# EAGLE design dongle (EAGLE 9.0.1)
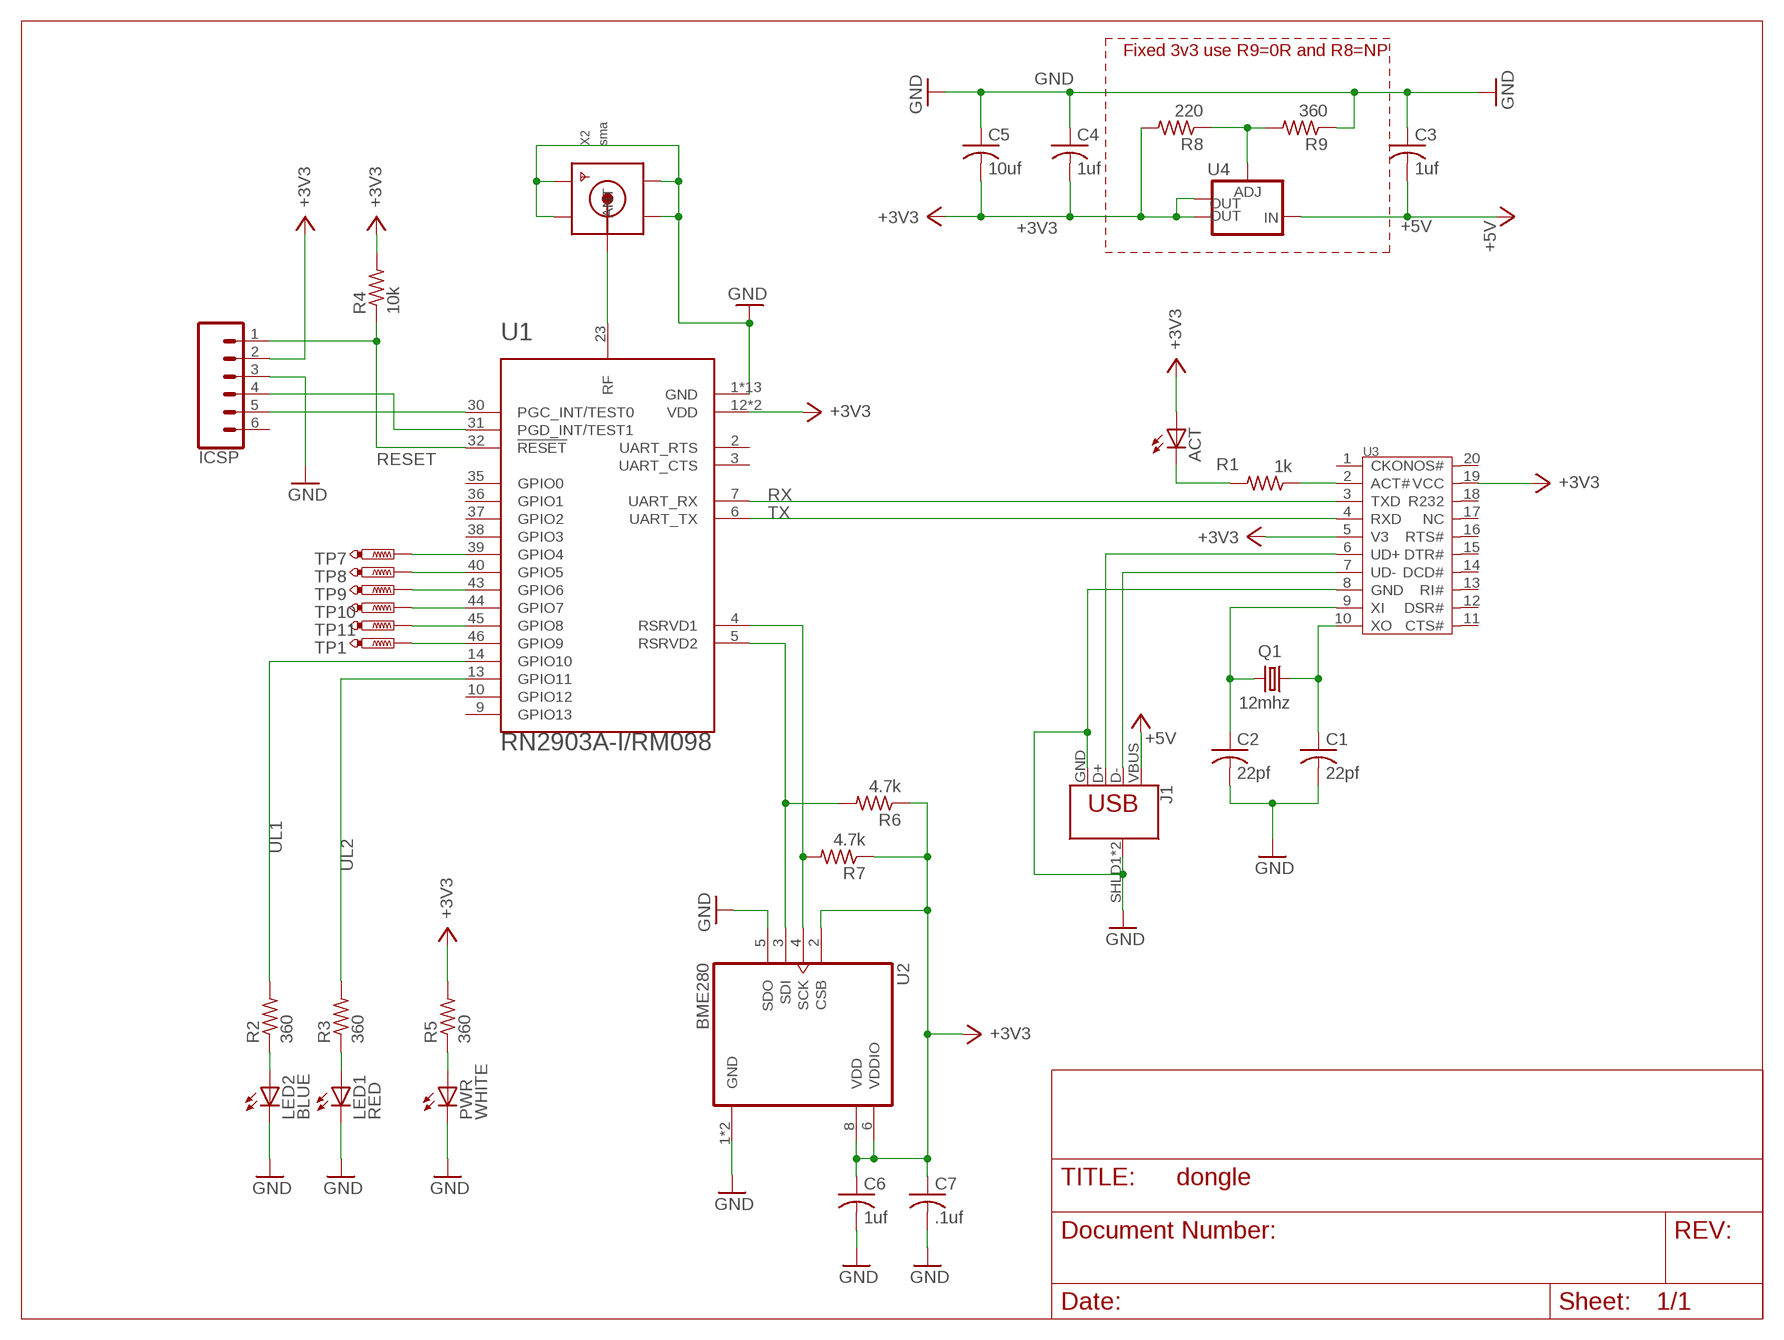
[diagram p0: schematic, sheet 1]

## Parts
ACT  LEDCHIP-LED0603  [CHIP-LED0603]
C1  22pf  C-USC0603K  [C0603K]
C2  22pf  C-USC0603K  [C0603K]
C3  1uf  C-USC0603K  [C0603K]
C4  1uf  C-USC0603K  [C0603K]
C5  10uf  C-USC1206K  [C1206K]
C6  1uf  C-USC0603K  [C0603K]
C7  .1uf  C-USC0603K  [C0603K]
ICSP  CONN_06SMD-FEMALE-V2  [1X06-SMD-FEMALE]
J1  USB_A_PTH_MALE  [USB-A-H]
LED1  RED  LEDCHIP-LED0603  [CHIP-LED0603]
LED2  BLUE  LEDCHIP-LED0603  [CHIP-LED0603]
PWR  WHITE  LEDCHIP-LED0603  [CHIP-LED0603]
Q1  12mhz  CRYSTALSM49  [SM49]
R1  1k  R-US_R0603  [R0603]
R2  360  R-US_R0603  [R0603]
R3  360  R-US_R0603  [R0603]
R4  10k  R-US_R0603  [R0603]
R5  360  R-US_R0603  [R0603]
R6  4.7k  R-US_R0603  [R0603]
R7  4.7k  R-US_R0603  [R0603]
R8  220  R-US_R0603  [R0603]
R9  360  R-US_R0603  [R0603]
TP1  PTR1B1,27  [B1,27]
TP7  PTR1B1,27  [B1,27]
TP8  PTR1B1,27  [B1,27]
TP9  PTR1B1,27  [B1,27]
TP10  PTR1B1,27  [B1,27]
TP11  PTR1B1,27  [B1,27]
U1  RN2903A-I/RM098  [XCVR_RN2903A-I/RM098]
U2  BME280  [PSON65P250X250X100-8N]
U3  INTERFACE-CH340T(SSOP20)  [SSOP20-0.65-7.6X5.2MM]
U4  V_REG_LM1117SOT223  [SOT223]
X2  sma  SMACONNECTOR_EDGE  [SMA_EDGELAUNCH]

## Nets
+3V3: ACT.A C4.2 C5.2 C6.1 C7.1 ICSP.2 R4.2 R5.2 R6.1 R7.1 R8.2 U1.12(VDD) U1.34(VDD) U2.2(CSB) U2.6(VDDIO) U2.8(VDD) U3.5(V3) U3.19(VCC) U4.2(OUT) U4.4(OUT)
+5V: C3.2 J1.VBUS U4.3(IN)
GND: C1.2 C2.2 C3.1 C4.1 C5.1 C6.2 C7.2 ICSP.3 J1.GND J1.SHLD1(SHIELD) J1.SHLD2(SHIELD) LED1.C LED2.C PWR.C R9.1 U1.1(GND) U1.8(GND) U1.11(GND) U1.20(GND) U1.21(GND) U1.22(GND) U1.24(GND) U1.26(GND) U1.27(GND) U1.28(GND) U1.33(GND) U1.41(GND) U1.47(GND) U2.1(GND) U2.5(SDO) U2.7(GND) U3.8(GND) X2.GND@1(GND4) X2.GND@2(GND3) X2.GND@3(GND2) X2.GND@4(GND1)
N$1: U1.23(RF) X2.P(ANT)
N$2: R1.1 U3.2(ACT#)
N$3: ACT.C R1.2
N$4: J1.D+ U3.6(UD+)
N$5: J1.D- U3.7(UD-)
N$6: C1.1 Q1.1 U3.10(XO)
N$7: C2.1 Q1.2 U3.9(XI)
N$9: ICSP.4 U1.31(PGD_INT/TEST1)
N$10: ICSP.5 U1.30(PGC_INT/TEST0)
N$11: R7.2 U1.4(RSRVD1) U2.4(SCK)
N$12: R6.2 U1.5(RSRVD2) U2.3(SDI)
N$13: LED2.A R2.1
N$14: LED1.A R3.1
N$17: PWR.A R5.1
N$21: TP1.TP U1.46(GPIO9)
N$22: R8.1 R9.2 U4.1(ADJ)
N$29: TP7.TP U1.39(GPIO4)
N$30: TP8.TP U1.40(GPIO5)
N$31: TP9.TP U1.43(GPIO6)
N$32: TP10.TP U1.44(GPIO7)
N$33: TP11.TP U1.45(GPIO8)
RESET: ICSP.1 R4.1 U1.32(!RESET)
RX: U1.7(UART_RX) U3.3(TXD)
TX: U1.6(UART_TX) U3.4(RXD)
UL1: R2.2 U1.14(GPIO10)
UL2: R3.2 U1.13(GPIO11)
Unconnected: ICSP.6 U1.2(UART_RTS) U1.3(UART_CTS) U1.9(GPIO13) U1.10(GPIO12) U1.35(GPIO0) U1.36(GPIO1) U1.37(GPIO2) U1.38(GPIO3) U3.1(CKO) U3.11(CTS#) U3.12(DSR#) U3.13(RI#) U3.14(DCD#) U3.15(DTR#) U3.16(RTS#) U3.17(NC) U3.18(R232) U3.20(NOS#)

## Notes on the sheet
- Fixed 3v3 use R9=0R and R8=NP

## Library data of the parts
ACT LED1 LED2 PWR = led:LED: LED OSRAM: - CHIPLED LG R971, LG N971, LY N971, LG Q971, LY Q971, LO R971, LY R971 LH N974, LH R974 LS Q976, LO Q976, LY Q976 LO Q996 - Hyper CHIPLED LW Q18S LB Q993, LB Q99A, LB R99A - SideLED LS A670, LO A670, LY A670, LG A670, LP A670 LB A673, LV A673, LT A673, LW A673 LH A674 LY A675 LS A676, LA A676, LO A676, LY A676, LW A676 LS A679, LY A679, LG A679 - Hyper Micro SIDELED® LS Y876, LA Y876, LO Y876, LY Y876 LT Y87S - SmartLED LW L88C, LW L88S LB L89C, LB L89S, LG L890 LS L89K, LO L89K, LY L89K LS L896, LA L896, LO L896, LY L896 - TOPLED LS T670, LO T670, LY T670, LG T670, LP T670 LSG T670, LSP T670, LSY T670, LOP T670, LYG T670 LG T671, LOG T671, LSG T671 LB T673, LV T673, LT T673, LW T673 LH T674 LS T676, LA T676, LO T676, LY T676, LB T676, LH T676, LSB T676, LW T676 LB T67C, LV T67C, LT T67C, LS T67K, LO T67K, LY T67K, LW E67C LS E67B, LA E67B, LO E67B, LY E67B, LB E67C, LV E67C, LT E67C LW T67C LS T679, LY T679, LG T679 LS T770, LO T770, LY T770, LG T770, LP T770 LB T773, LV T773, LT T773, LW T773 LH T774 LS E675, LA E675, LY E675, LS T675 LS T776, LA T776, LO T776, LY T776, LB T776 LHGB T686 LT T68C, LB T68C - Hyper Mini TOPLED® LB M676 - Mini TOPLED Santana® LG M470 LS M47K, LO M47K, LY M47K Source: http://www.osram.convergy.de LUXEON: - LUMILED® LXK2-PW12-R00, LXK2-PW12-S00, LXK2-PW14-U00, LXK2-PW14-V00 LXK2-PM12-R00, LXK2-PM12-S00, LXK2-PM14-U00 LXK2-PE12-Q00, LXK2-PE12-R00, LXK2-PE12-S00, LXK2-PE14-T00, LXK2-PE14-U00 LXK2-PB12-K00, LXK2-PB12-L00, LXK2-PB12-M00, LXK2-PB14-N00, LXK2-PB14-P00, LXK2-PB14-Q00 LXK2-PR12-L00, LXK2-PR12-M00, LXK2-PR14-Q00, LXK2-PR14-R00 LXK2-PD12-Q00, LXK2-PD12-R00, LXK2-PD12-S00 LXK2-PH12-R00, LXK2-PH12-S00 LXK2-PL12-P00, LXK2-PL12-Q00, LXK2-PL12-R00 Source: www.luxeon.com KINGBRIGHT: KA-3528ASYC Source: www.kingbright.com
C1-C4 C6 C7 = rcl:C-US: CAPACITOR, American symbol; SPICEPREFIX: C
C5 = resistor:C-US: CAPACITOR, American symbol
ICSP = SparkFun-Connectors:CONN_06: Multi connection point. Often used as Generic Header-pin footprint for 0.1 inch spaced/style header connections On any of the 0.1 inch spaced packages, you can populate with these: Break Away Headers - Straight <https://www.sparkfun.com/products/116> (PRT-00116) Break Away Male Headers - Right Angle <https://www.sparkfun.com/products/553> (PRT-00553) Female Headers <https://www.sparkfun.com/products/115> (PRT-00115) Break Away Headers - Machine Pin <https://www.sparkfun.com/products/117> (PRT-00117) Break Away Female Headers - Swiss Machine Pin <https://www.sparkfun.com/products/743> (PRT-00743) Arduino Stackable Header - 6 Pin <https://www.sparkfun.com/products/9280> (PRT-09280) For SCREWTERMINALS and SPRING TERMINALS visit here: Screw Terimnals on SparkFun.com <https://www.sparkfun.com/search/results?term=Screw+Terminals> (5mm/3.5mm/2.54mm spacing) This device is also useful as a general connection point to wire up your design to another part of your project. Our various solder wires solder well into these plated through hole pads. Hook-Up Wire - Assortment (Stranded, 22 AWG) <https://www.sparkfun.com/products/11375> (PRT-11375) Hook-Up Wire - Assortment (Solid Core, 22 AWG) <https://www.sparkfun.com/products/11367> (PRT-11367) View the entire wire category on our website here <https://www.sparkfun.com/categories/141>; PROD_ID: CONN-09668
J1 = SparkFun-Connectors:USB_A: USB-A Connector Male and female variants, as well as PTH and SMT variants SparkFun Products: SparkFun XBee Explorer Dongle <https://www.sparkfun.com/products/11697> PTH Male SparkFun MicroView-USB Programmer <https://www.sparkfun.com/products/12924> SMT Male SparkFun USB Type A Female Breakout <https://www.sparkfun.com/products/12700> SMT Female; PROD_ID: CONN-08367; SF_ID: PRT-00437
Q1 = crystal:CRYSTAL: CRYSTAL; OC_FARNELL: unknown; OC_NEWARK: unknown
R1-R9 = resistor:R-US_: RESISTOR, American symbol
TP1 TP7-TP11 = testpad:PTR1: TEST PIN
U1 = bitsetters:RN2903A-I/RM098: 300kbps 18.5 dBm LoRa (Low Power Long Range) 915 MHz Transceiver Module; AVAILABILITY: Bad; DESCRIPTION: 300kbps 18.5 dBm LoRa _Low Power Long Range_ 915 MHz Transceiver Module; MF: Microchip; MP: RN2903A-I/RM098; PACKAGE: Module Microchip; PRICE: 12.18 USD
U2 = BME280:BME280: DIGITAL HUMIDITY, PRESSURE AND TEMPERATURE SENSOR * Digital interface I²C (up to 3.4 MHz) and SPI (3 and 4 wire, up to 10 MHz)* Supply voltage VDD main supply voltage range: 1.71 V to 3.6 V*VDDIO interface voltage range: 1.2 V to 3.6 V Operating range -40…+85 °C, 0…100 % rel. humidity, 300…1100 hPa The library has been designed by Richard Magdycz <https://www.facebook.com/groups/eaglecadsoftUK>; DESCRIPTION: Integrated pressure, humidity and temperature sensor; 8-pin 2.5x2.5x0.93mm LGA; DIGI-KEY_PART_NUMBER: 828-1063-1-ND; DIGI-KEY_PURCHASE_URL: https://www.digikey.com/product-detail/en/bosch-sensortec/BME280/828-1063-1-ND/6136314?utm_source=snapeda&utm_medium=aggregator&utm_campaign=symbol; MF: Bosch; MP: BME280; PACKAGE: LGA-8 Bosch
U3 = CH340T_SSOP20_:INTERFACE-CH340T(SSOP20): 310070026; AVAILABILITY: Unavailable; MF: Nanjing QinHeng Electronics; MP: CH340T; PACKAGE: None; PRICE: None
U4 = SparkFun-IC-Power:V_REG_LM1117: Voltage Regulator LM1117 Standard adjustable voltage regulator but in SMD form. Spark Fun Electronics SKU : COM-00595; PROD_ID: VREG-08170
X2 = adafruit:SMACONNECTOR: SMA Connector 90° DIP SMA Connector, 50 Ohm (4UConnector: 07259)

## Board
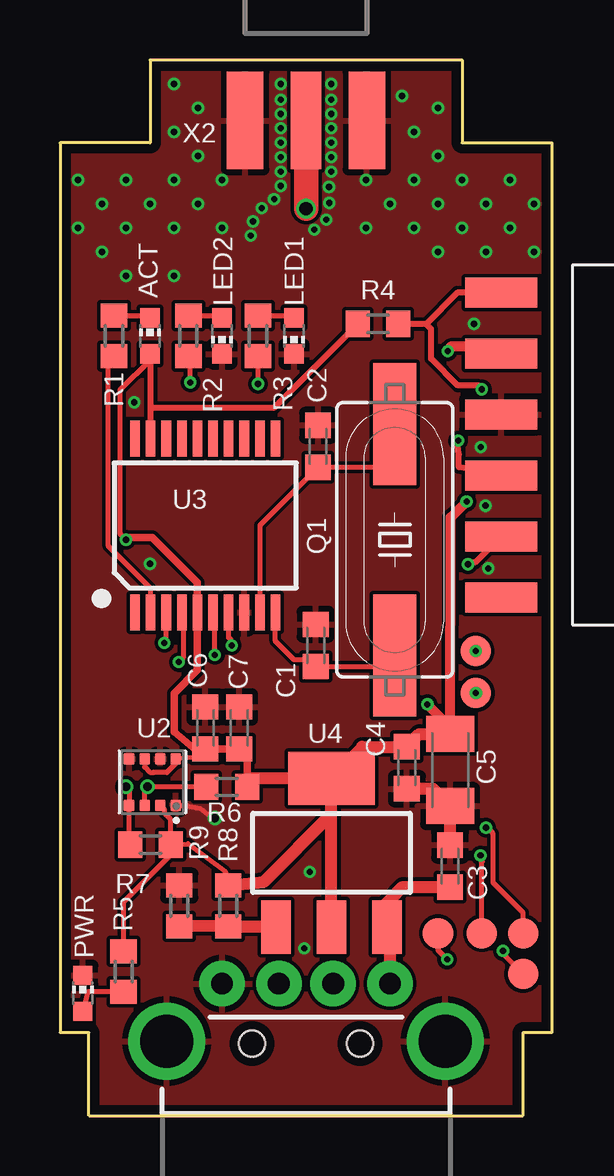
[diagram p1: board, top side]
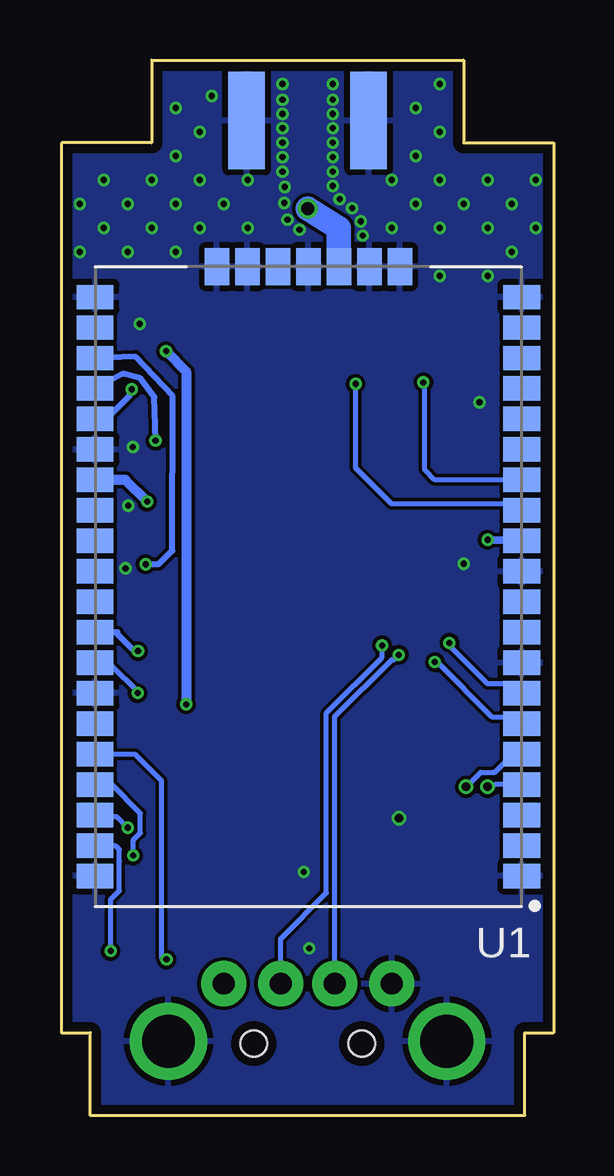
[diagram p2: board, bottom side, seen from below]

Size 20.5 x 44 mm. Coordinates in mm from the lower left corner, seen from the top.
Copper layers (1*16): Top 0.0356mm / dielectric 1.5011mm / Bottom 0.0356mm
Design rules "LaenPCBOrder *": minimum track width 6mil, minimum drill 10mil, track to track 6mil, track to pad 6mil, pad to pad 6mil, via to via 6mil, smd to smd 6mil, copper to edge 15mil, drill to drill 6mil, minimum pad ring 5mil, minimum via ring 5mil, stop-mask expansion 4mil, vias tented up to drill 15mil, thermal gap 10mil

### Footprints (pad centres in the part's own frame; a part is rotated, then mirrored left to right if it is on the bottom)
CHIP-LED0603 = smd 0.8 x 0.8: A 0,-0.75; C 0,0.75
C0603K = smd 1.05 x 1.08: 1 -0.875,0; 2 0.875,0
C1206K = smd 1.5 x 2: 1 -1.5,0; 2 1.5,0
1X06-SMD-FEMALE = smd 1.25 x 3: 1 6.35,3.425; 2 3.81,3.425; 3 1.27,3.425; 4 -1.27,3.425; 5 -3.81,3.425; 6 -6.35,3.425
USB-A-H = drill 0.914 pad 1.88: D+ 2.4,1.127; D- 2.4,-1.127; GND 2.4,3.5; VBUS 2.4,-3.5 | drill 2.2: SHLD1 0,-5.8; SHLD2 0,5.8 | hole 1.1: -0.1,2.25; -0.1,-2.25
SM49 = smd 5.08 x 1.778: 1 -4.826,0; 2 4.826,0
R0603 = smd 1 x 1.1: 1 -0.85,0; 2 0.85,0
B1,27 = smd 1.27 x 1.27: TP 0,0
XCVR_RN2903A-I/RM098 = smd 1.524 x 1.016: 1 8.89,-12.065; 2 8.89,-10.795; 3 8.89,-9.525; 4 8.89,-8.255; 5 8.89,-6.985; 6 8.89,-5.715; 7 8.89,-4.445; 8 8.89,-3.175; 9 8.89,-1.905; 10 8.89,-0.635; 11 8.89,0.635; 12 8.89,1.905; 13 8.89,3.175; 14 8.89,4.445; 15 8.89,5.715; 16 8.89,6.985; 17 8.89,8.255; 18 8.89,9.525; 19 8.89,10.795; 20 8.89,12.065; 28 -8.89,12.065; 29 -8.89,10.795; 30 -8.89,9.525; 31 -8.89,8.255; 32 -8.89,6.985; 33 -8.89,5.715; 34 -8.89,4.445; 35 -8.89,3.175; 36 -8.89,1.905; 37 -8.89,0.635; 38 -8.89,-0.635; 39 -8.89,-1.905; 40 -8.89,-3.175; 41 -8.89,-4.445; 42 -8.89,-5.715; 43 -8.89,-6.985; 44 -8.89,-8.255; 45 -8.89,-9.525; 46 -8.89,-10.795; 47 -8.89,-12.065 | smd 1.016 x 1.524: 21 3.81,13.335; 22 2.54,13.335; 23 1.27,13.335; 24 0,13.335; 25 -1.27,13.335; 26 -2.54,13.335; 27 -3.81,13.335
PSON65P250X250X100-8N = smd 0.49 x 0.45: 1 0.97,0.975; 2 0.97,0.325; 3 0.97,-0.325; 4 0.97,-0.975; 5 -0.97,-0.975; 6 -0.97,-0.325; 7 -0.97,0.325; 8 -0.97,0.975
SSOP20-0.65-7.6X5.2MM = smd 0.4 x 1.5: 1 -2.925,-3.625; 2 -2.275,-3.625; 3 -1.625,-3.625; 4 -0.975,-3.625; 5 -0.325,-3.625; 6 0.325,-3.625; 7 0.975,-3.625; 8 1.625,-3.625; 9 2.275,-3.625; 10 2.925,-3.625; 11 2.925,3.625; 12 2.275,3.625; 13 1.625,3.625; 14 0.975,3.625; 15 0.325,3.625; 16 -0.325,3.625; 17 -0.975,3.625; 18 -1.625,3.625; 19 -2.275,3.625; 20 -2.925,3.625
SOT223 = smd 1.219 x 2.235: 1 -2.311,-3.099; 2 0,-3.099; 3 2.311,-3.099 | smd 3.6 x 2.2: 4 0,3.099
SMA_EDGELAUNCH = smd 4.064 x 1.524: GND@1 2.032,-2.54; GND@2 2.032,2.54 | smd 4.064 x 1.524 bottom: GND@3 2.032,2.54; GND@4 2.032,-2.54 | smd 4.064 x 1.27: P 2.032,0

### Placement (x,y rotation side)
ACT  3.75,32.5 0 top
C1  10.65,19.6 90 top
C2  10.75,27.9 90 top
C3  16.25,10.4 270 top
C4  14.45,14.5 90 top
C5  16.25,14.4 90 top
C6  6.06,16.16 90 top
C7  7.47,16.16 90 top
ICSP  21.8,27.95 90 top
J1  10.25,3.1 90 top
LED1  9.75,32.5 180 top
LED2  6.75,32.5 180 top
PWR  0.95,5.1 0 top
Q1  13.95,24 90 top
R1  2.25,32.5 90 top
R2  5.35,32.5 270 top
R3  8.25,32.5 270 top
R4  13.25,33 180 top
R5  2.65,6 90 top
R6  6.95,13.7 180 top
R7  3.77,11.29 180 top
R8  7.01,8.74 90 top
R9  4.97,8.74 270 top
TP1  19.3,5.9 0 top
TP7  17.32,19.36 0 top
TP8  17.33,17.61 0 top
TP9  15.75,7.6 0 top
TP10  17.58,7.6 0 top
TP11  19.3,7.6 90 top
U1  10.22,22.05 0 bottom
U2  3.85,13.9 270 top
U3  6.05,24.6 0 top
U4  11.31,10.95 0 top
U$1  [1551USB2]  10.25,22 0 top
X2  10.25,43.51 270 top

### Tracks (layer width: path | path; a pad name or v marks a point on that pad's centre or on a via)
+3V3  (via drill 0.25)
  Top 0.2: 7.8,15.07 C7.1 7.3,15.29 | C6.1 5.88,15.14 | 5.88,15.14 5.79,14.94 U2.8 4.83,14.68 4.45,14.3 3.91,14.3 3.9,14.3 3.75,14.3 3.52,14.53 U2.6 | U2.2 4.35,12.76 4.35,12.61 4.6,12.36 R7.1 | R7.1 5.34,11.33 6.88,10.17 R8.2 | R5.2 2.65,8.9 4.6,10.85 R7.1 | 5.88,15.14 5.78,15.14 | ACT.A 3.75,31.5 2.49,30.24 2.49,24.26 v2.75,24
  Top 0.254: U3.19 3.78,29.5 | 3.78,29.5 3.78,31.48 3.75,31.5 | R4.2 8.9,29.5 3.78,29.5 | 17.51,31.76 ICSP.2 18.09,32.05 | 16.25,24.53 16.28,24.5 | 16.27,32.05 16.27,31.98
  Top 0.305: R6.1 7.8,14 7.8,15.07 | 7.3,15.29 C6.1 | 5.78,15.14 4.75,16 4.75,17.6 5.72,18.57 U3.5 5.72,22.23 3.85,24.1 2.85,24.1 v2.75,24
  Top 0.406: C5.2 16.25,16.33 | 16.25,16.33 16.28,24.5 16.28,24.93 v16.94,25.59 | 18.09,32.05 16.27,32.05 | 16.27,31.98 v16.15,31.86 | v15.31,17.14 16.12,16.33 16.25,16.33
  Top 0.508: C5.2 14.97,15.9 C4.2 12.57,15.38 12.57,15.31 U4.4 | R8.2 8.5,9.75 11.31,12.56 | 11.31,12.56 U4.4 | U4.2 11.31,12.56 | U4.4 7.85,14.05 7.8,14
  Bottom 0.2: 1.38,24 U1.12
  Bottom 0.305: v2.75,24 1.38,24
  Bottom 0.406: v16.94,25.59 17.84,26.5 U1.34 | v16.15,31.86 15.31,31.02 v15.31,17.14
+5V
  Top 0.508: 13.75,9 14.28,9.53 C3.2 | J1.VBUS 13.75,9 | U4.3 13.62,8.87 13.75,9
  Top 1.27: J1.VBUS 13.65,5.6
GND  (via drill 0.25, 0.35)
  Top 0.2: U2.1 5.26,12.93 5.29,12.9 5.85,12.8 6.35,12.4 v6.45,12.4
  Top 0.508: C4.1 15.53,13.62 C5.1 C3.1
  other vias: 0.75,39 0.75,37 1.75,38 2.75,39 3.75,38 2.75,37 1.75,36 2.75,35 4.75,35 4.75,37 6.75,37 8.4,37.82 9.2,39.35 15.75,40 14.75,39 12.75,39 12.75,37 19.75,36 19.75,38 17.75,36 18.75,37 15.75,36 16.75,37 17.75,38 18.75,39 14.75,37 15.75,38 16.75,39 14.75,41 15.75,42 14.25,42.5 5.75,38 4.75,39 5.75,40 4.75,41 5.75,42 4.75,43 11.21,38.71 13.75,38 6.75,39 17.25,33 17.73,25.42 17.84,22.81 3.75,23 3.09,29.73 17.53,27.87 10.18,6.97 10.41,10.16 8.92,38.2 8.04,37.27 11.3,39.35 11.22,38.04 11.09,37.35 10.59,36.93 9.2,38.75 9.2,39.95 9.2,40.55 9.2,41.15 9.2,43 9.2,42.35 9.2,41.75 11.3,39.95 11.3,40.55 11.3,41.15 11.3,41.75 11.3,42.35 11.3,43 7.95,36.68
  pour Bottom: -1.75,-0.5 -1.75,43.5 1.75,45 20.75,45 21.75,44 21.75,1 20.75,-1
  pour Top: -3.25,-1.5 -3.25,43.5 0.75,44 19.75,44 20.75,43 20.75,1 19.75,-2
N$1  (via drill 0.55)
  Top 1.016: X2.P v10.25,37.8
  Bottom 1.016: U1.23 8.95,37 v10.25,37.8
N$2
  Top 0.2: U3.2 3.78,21.98 3.25,22.5 2.02,23.73 2.02,31.42 R1.1
N$3
  Top 0.2: R1.2 3.65,33.35 ACT.C
N$4  (via drill 0.25)
  Top 0.2: v6.45,19.2 6.45,20.9 U3.6
  Bottom 0.2: J1.D+ 9.12,16.63 6.75,19 6.65,19 v6.45,19.2
N$5  (via drill 0.25)
  Top 0.2: v7.15,19.6 7.15,19.8 7.03,19.93 U3.7
  Bottom 0.2: J1.D- 11.38,7.37 9.47,9.28 9.47,16.77 7.15,19.1 v7.15,19.6
N$6
  Top 0.2: Q1.1 13.5,18.73 C1.1 10.38,19 9.75,19 8.97,19.77 U3.10
N$7
  Top 0.2: U3.9 8.32,24.6 C2.1 13.68,27.02 14.25,27.6 13.95,27.9 Q1.2
N$9  (via drill 0.25)
  Top 0.254: ICSP.4 16.62,27.02 16.62,27.57 16.57,27.92 v16.59,28.13
  Bottom 0.254: v16.59,28.13 16.64,29.94 17.23,30.73 17.96,30.93 U1.31
N$10  (via drill 0.25)
  Top 0.254: ICSP.5 17.3,23.06 17.06,23.06 17,23 v17,22.98
  Bottom 0.254: v17,22.98 16.46,22.98 15.89,23.55 15.88,29.98 17.43,31.64 U1.30
N$11  (via drill 0.35)
  Top 0.2: v2.75,13.7 2.88,13.57 U2.4 2.88,11.72 R7.2
  Bottom 0.2: U1.4 2.44,13.79 2.45,13.8 2.55,13.7 v2.75,13.7
N$12  (via drill 0.35)
  Top 0.2: U2.3 3.52,13.57 v3.65,13.7 R6.2
  Bottom 0.2: 2.5,14.3 2.49,14.3 | v3.65,13.7 3.04,14.3 2.5,14.3 | U1.5 1.69,15.06 2.45,14.3 2.5,14.3
N$13
  Top 0.2: R2.1 6.65,33.35 LED2.A
N$14
  Top 0.2: R3.1 9.65,33.35 LED1.A
N$17
  Top 0.2: R5.1 1.15,5.15 PWR.A
N$21  (via drill 0.25)
  Top 0.2: TP1.TP 18.45,6.75 18.43,6.75 18.43,6.83 v18.46,6.86
  Bottom 0.2: v18.46,6.86 18.46,9.01 18.1,9.37 18.1,10.6 18.1,11.09 18.24,11.23 19.09,11.23 U1.46
N$22
  Top 0.508: 7.25,7.85 R8.1 | R8.1 5.46,7.9 R9.2 | R8.1 8.96,7.89 U4.1
N$29  (via drill 0.25)
  Bottom 0.2: U1.39 18.75,20.14 18.41,20.14
  Bottom 0.254: 18.18,20.14 18.25,20.14 | 18.25,20.14 18.75,20.14 | 18.25,20.14 17.45,19.35 17.34,19.35 TP7.TP
  other vias: 17.32,19.36
N$30  (via drill 0.25)
  Bottom 0.2: U1.40 18.54,18.88 17.25,17.59 17.25,17.5 TP8.TP
  other vias: 17.33,17.61
N$31  (via drill 0.25)
  Top 0.2: v16.13,6.51 15.75,6.89 TP9.TP
  Bottom 0.2: U1.43 17.45,15.06 16.35,13.96 16.35,6.59 16.19,6.43 16.13,6.49 v16.13,6.51
N$32  (via drill 0.25)
  Top 0.2: TP10.TP 17.58,10.57 17.6,10.59 17.52,10.67 v17.52,10.84
  Bottom 0.2: v17.52,10.84 17.52,11.48 17.22,11.78 17.22,12.6 18.41,13.79 U1.44
N$33  (via drill 0.25)
  Top 0.2: TP11.TP 19.3,8.45 18.05,9.7 18.05,11.76 17.9,11.91 17.84,11.91 v17.75,12
  Bottom 0.2: v17.75,12 18.19,12.44 19.02,12.44 U1.45
RESET  (via drill 0.25)
  Top 0.254: ICSP.1 16.55,34.3 15.25,33 | 15.25,33 R4.1 | v17.57,30.27 17.41,30.43 16.58,30.43 15.46,31.55 15.46,32.79 15.25,33
  Bottom 0.254: v17.57,30.27 17.65,30.27 17.68,30.24 17.68,29.99 18.64,29.04 U1.32
RX  (via drill 0.25)
  Top 0.2: v4.35,19.7 4.42,19.77 U3.3
  Bottom 0.2: U1.7 1.73,18 2.75,18 4.35,19.6 4.45,19.6 v4.35,19.7
TX  (via drill 0.25)
  Top 0.2: v4.95,18.9 5.15,19.1 5.15,20.9 U3.4
  Bottom 0.2: U1.6 1.59,16.6 2.55,16.6 4.85,18.9 v4.95,18.9
UL1  (via drill 0.25)
  Top 0.2: v5.43,30.56 5.43,31.57 R2.2
  Bottom 0.2: U1.14 4.95,26.5 5.38,26.93 5.38,30.6 v5.42,30.56 v5.43,30.56
UL2  (via drill 0.25)
  Top 0.2: v8.25,30.5 R3.2
  Bottom 0.2: U1.13 1.6,25.5 6.75,25.5 8.25,27 v8.25,30.5